# Altium schematic sheet Multiplexers.SchDoc
size A; DocumentNumber: 5; SheetNumber: 5; SheetTotal: 5
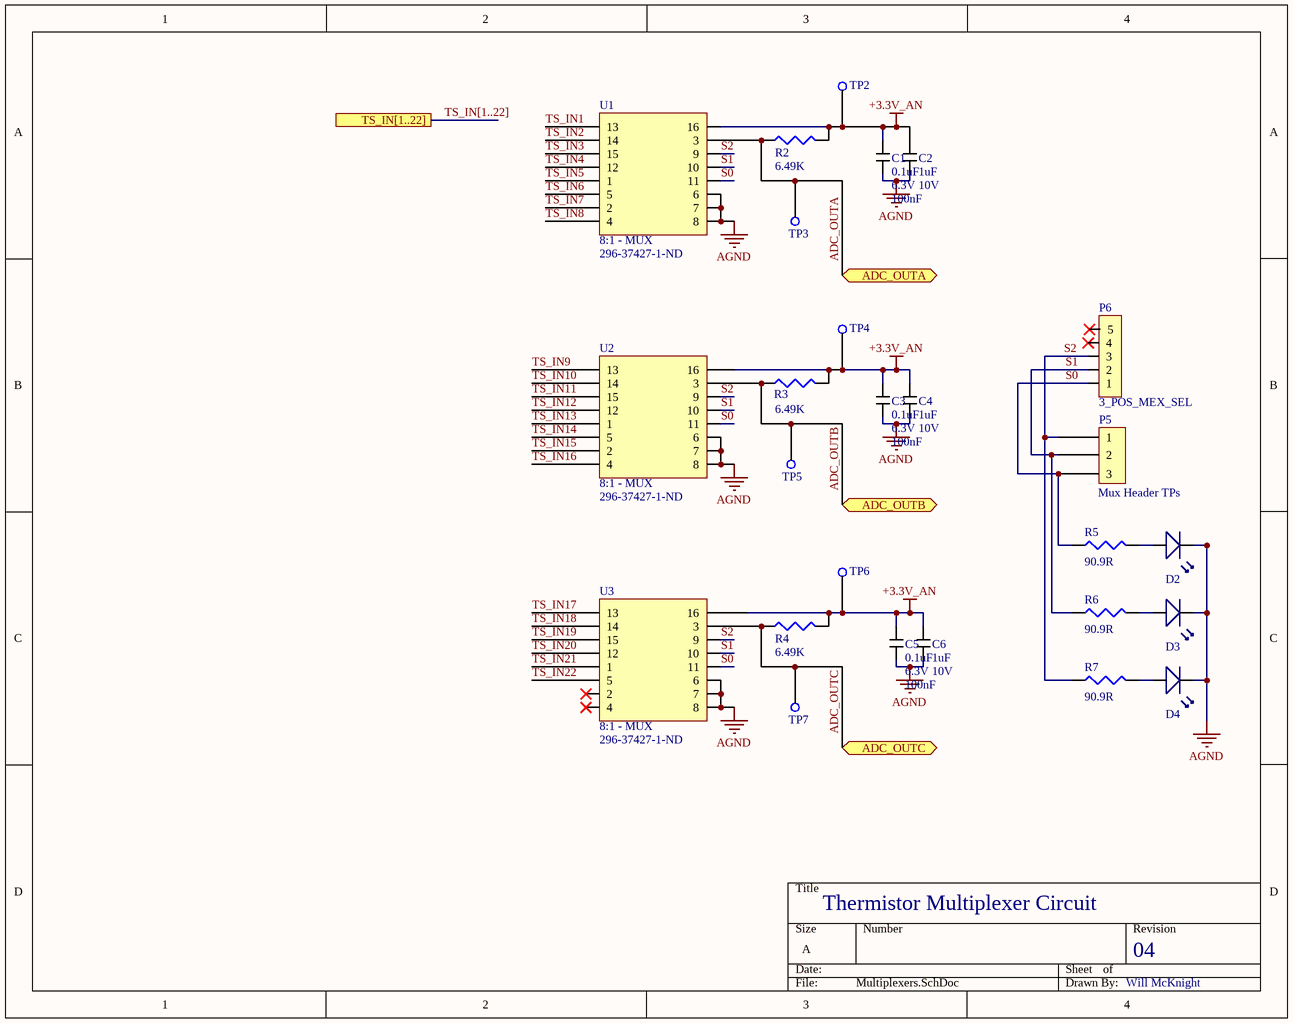
[diagram p0: Multiplexers.SchDoc]

## Parts
C1  0.1uF  Voltage Rating: 6.3V  Capacitance: 100nF  [0.1uF Bypass Capacitor]
C2  Voltage Rating: 10V  [1UF_SAMSUNG]  (hidden comment: 1uF)
C3  0.1uF  Voltage Rating: 6.3V  Capacitance: 100nF  [0.1uF Bypass Capacitor]
C4  Voltage Rating: 10V  [1UF_SAMSUNG]  (hidden comment: 1uF)
C5  0.1uF  Voltage Rating: 6.3V  Capacitance: 100nF  [0.1uF Bypass Capacitor]
C6  Voltage Rating: 10V  [1UF_SAMSUNG]  (hidden comment: 1uF)
D2  LED  [Green_SMD_LED]  (value not drawn)
D3  LED  [Green_SMD_LED]  (value not drawn)
D4  LED  [Green_SMD_LED]  (value not drawn)
P5  3 POS Mux Select Header  [Mux Select 3 Pos Header Pin]  (value not drawn)
P6  3_POS_MEX_SEL  [3POS_MUX_SEL]
R2  Resistance: 6.49K  [RESC2012X06N]  (hidden comment: 6.49kOhm SMD Resistor)
R3  Resistance: 6.49K  [RESC2012X06N]  (hidden comment: 6.49kOhm SMD Resistor)
R4  Resistance: 6.49K  [RESC2012X06N]  (hidden comment: 6.49kOhm SMD Resistor)
R5  Resistance: 90.9R  [Green_LED_Resistor_90.9]  (hidden comment: Green_LED_Res)
R6  Resistance: 90.9R  [Green_LED_Resistor_90.9]  (hidden comment: Green_LED_Res)
R7  Resistance: 90.9R  [Green_LED_Resistor_90.9]  (hidden comment: Green_LED_Res)
TP2  Test Point  [Test Point]  (value not drawn)
TP3  Test Point  [Test Point]  (value not drawn)
TP4  Test Point  [Test Point]  (value not drawn)
TP5  Test Point  [Test Point]  (value not drawn)
TP6  Test Point  [Test Point]  (value not drawn)
TP7  Test Point  [Test Point]  (value not drawn)
U1  8:1 - MUX  Supplier Part Number 1: 296-37427-1-ND  [8x1 16SOIC MUX]
U2  8:1 - MUX  Supplier Part Number 1: 296-37427-1-ND  [8x1 16SOIC MUX]
U3  8:1 - MUX  Supplier Part Number 1: 296-37427-1-ND  [8x1 16SOIC MUX]

## Ports
ADC_OUTA (bidir), ADC_OUTB (bidir), ADC_OUTC (bidir), TS_IN[1..22]

## Nets
+3.3V_AN: C1.2 C2.2 C3.2 C4.2 C5.2 C6.2 R2.2 R3.2 R4.2 TP2.1 TP4.1 TP6.1 U1.16 U2.16 U3.16
AGND: C1.1 C2.1 C3.1 C4.1 C5.1 C6.1 D2.1 D3.1 D4.1 U1.6 U1.7 U1.8 U2.6 U2.7 U2.8 U3.6 U3.7 U3.8
ADC_OUTA: R2.1 TP3.1 U1.3 ; port ADC_OUTA
ADC_OUTB: R3.1 TP5.1 U2.3 ; port ADC_OUTB
ADC_OUTC: R4.1 TP7.1 U3.3 ; port ADC_OUTC
S0: P5.3 P6.1 R5.1 U1.11 U2.11 U3.11
S1: P5.2 P6.2 R6.1 U1.10 U2.10 U3.10
S2: P5.1 P6.3 R7.1 U1.9 U2.9 U3.9
TS_IN1: U1.13
TS_IN2: U1.14
TS_IN3: U1.15
TS_IN4: U1.12
TS_IN5: U1.1
TS_IN6: U1.5
TS_IN7: U1.2
TS_IN8: U1.4
TS_IN9: U2.13
TS_IN10: U2.14
TS_IN11: U2.15
TS_IN12: U2.12
TS_IN13: U2.1
TS_IN14: U2.5
TS_IN15: U2.2
TS_IN16: U2.4
TS_IN17: U3.13
TS_IN18: U3.14
TS_IN19: U3.15
TS_IN20: U3.12
TS_IN21: U3.1
TS_IN22: U3.5
NetD2_2: D2.2 R5.2
NetD3_2: D3.2 R6.2
NetD4_2: D4.2 R7.2

Not connected (* = marked no-connect by the designer): P6 4* 5*; U3 2* 4*

## Buses and harness runs
bus TS_IN[1..22] = port TS_IN[1..22]

## Notes on the sheet
- (near P5) Mux Header TPs
- Thermistor Multiplexer Circuit
- 04
- Will McKnight

## Library data of the parts
C1 C3 C5 = 0.1uF Cap: 0.1uF Bypass Cap; Manufacturer: KEMET; Manufacturer Part Number: C0603C104K9RACTU; Dielectric Material: Ceramic; Tolerance: 10%; Dielectric: X7R; Dissipation Factor: 5%; Supplier 1: Digi-Key; Supplier Part Number 1: 399-15351-1-ND; RoHS: Yes; Mount: Surface Mount; Case/Package: 0603; Case Code (Imperial): 0603; Case Code (Metric): 1608; Min Operating Temperature: -55°C; Max Operating Temperature: 125°C; Package Quantity: 4000; Packaging: Tape and Reel; Voltage Rating (DC): 6.3V; Termination: SMD/SMT; Length: 1.6mm; Height: 0.8mm; Width: 0.8mm; Thickness: 0.034inch; ComponentLink1URL: https://datasheet.ciiva.com/13371/kem-c1002-x7r-smd-357932-13371879.pdf?src-supplier=Mouser; ComponentLink1Description: https://datasheet.ciiva.com/13371/kem-c1002-x7r-smd-357932-13371879.pdf?src-supplier=Mouser; Stock 1: 758; Pricing 1: 1=0.19000, 10=0.13800, 100=0.06480, 500=0.04546, 1000=0.03763 (USD)
C2 C4 C6 = 1uF Samsung Cap: Manufacturer Part Number: CL10B105KP8NNNC; Tolerance: 10%; Dielectric: X7R; Supplier 1: Digi-Key; Supplier Part Number 1: 1276-1946-1-ND; Manufacturer: Samsung; Mount: Surface Mount; Case/Package: 0603; Case Code (Metric): 1608; Case Code (Imperial): 0603; Contact Plating: Tin; Min Operating Temperature: -55°C; Max Operating Temperature: 125°C; Package Quantity: 1; Packaging: Tape and Reel; Voltage Rating (DC): 10V; Length: 1.6mm; Height: 0.8mm; Width: 0.031inch; Thickness: 0.035inch; Depth: 0.8mm; Radiation Hardening: No; Lead Free: Lead Free; ComponentLink1URL: https://media.digikey.com/pdf/Data%20Sheets/Samsung%20PDFs/CL_Series_MLCC_ds.pdf?src-supplier=Digi-Key; ComponentLink1Description: https://media.digikey.com/pdf/Data%20Sheets/Samsung%20PDFs/CL_Series_MLCC_ds.pdf?src-supplier=Digi-Key; ComponentLink2URL: http://www1.futureelectronics.com/doc/SAMSUNG/CL10B105KP8NNNC.pdf?src-supplier=Future+Electronics; ComponentLink2Description: http://www1.futureelectronics.com/doc/SAMSUNG/CL10B105KP8NNNC.pdf?src-supplier=Future+Electronics; ComponentLink3URL: https://www.verical.com/server-webapp/html/getDatasheet?partID=358410&src-supplier=Verical; ComponentLink3Description: https://www.verical.com/server-webapp/html/getDatasheet?partID=358410&src-supplier=Verical; Stock 1: 10781730; Pricing 1: 1=0.1, 10=0.052, 100=0.0233, 500=0.0166, 1000=0.0131 (USD); Capacitance: 1uF
D2-D4 = GREEN_LED: Manufacturer: Dialight; Manufacturer Part Number: 5988070107F; Color: Green; Lens Color: Colorless,Clear; Forward Voltage: 2V; Forward Current: 20mA; Wavelength: 570nm; Luminous Intensity: 20mcd; Viewing Angle: 140°; Lens Style: Flat,Rectangular,Diffused,Colorless,Clear; Dominant Wavelength: 568nm; Number of Elements: 1; Power Dissipation: 60mW; Reverse Voltage: 5V; Lens Transparency: Clear; Lens Size: 0.8mm; Supplier 1: Digi-Key; Stock 1: 228546; Pricing 1: 1=0.46, 10=0.33, 25=0.2528, 100=0.1648, 250=0.1209, 500=0.1026, 1000=0.0843 (USD); Mount: Surface Mount; Case/Package: 0603; Number of Pins: 2; Case Code (Metric): 1608; Case Code (Imperial): 0603; Min Operating Temperature: -30°C; Max Operating Temperature: 100°C; Package Quantity: 4000; Packaging: Tape and Reel; Illumination Color: Green; Test Current: 20mA; Number of LEDs: 1; Length: 1.6mm; Height: 0.7mm; Depth: 0.8mm; Width: 0.8mm; Radiation Hardening: No; Lead Free: Lead Free; REACH SVHC: No SVHC; ComponentLink1URL: http://www.mouser.com/ds/2/109/SMT_selector_guide-267443.pdf?src-supplier=Mouser; ComponentLink1Description: http://www.mouser.com/ds/2/109/SMT_selector_guide-267443.pdf?src-supplier=Mouser; ComponentLink2URL: http://uk.rs-online.com/webdocs/0ae2/0900766b80ae2975.pdf?src-supplier=RSComponents; ComponentLink2Description: http://uk.rs-online.com/webdocs/0ae2/0900766b80ae2975.pdf?src-supplier=RSComponents; ComponentLink3URL: http://www.farnell.com/datasheets/1720200.pdf?src-supplier=Element14; ComponentLink3Description: http://www.farnell.com/datasheets/1720200.pdf?src-supplier=Element14; ComponentLink4URL: https://media.digikey.com/pdf/Data%20Sheets/Dialight%20PDFs/598_Series_0603_Pkg.pdf?src-supplier=Digi-Key; ComponentLink4Description: https://media.digikey.com/pdf/Data%20Sheets/Dialight%20PDFs/598_Series_0603_Pkg.pdf?src-supplier=Digi-Key; ComponentLink5URL: http://www.farnell.com/datasheets/1484480.pdf?src-supplier=Element14; ComponentLink5Description: http://www.farnell.com/datasheets/1484480.pdf?src-supplier=Element14; ComponentLink6URL: https://www.alliedelec.com/m/d/745256ca487aea7b70ea31e2d673d5bb.pdf?src-supplier=Allied+Electronics; ComponentLink6Description: https://www.alliedelec.com/m/d/745256ca487aea7b70ea31e2d673d5bb.pdf?src-supplier=Allied+Electronics; ComponentLink7URL: http://www.onlinecomponents.com/productFiles/mf-DIA/mdei5980603.pdf?src-supplier=Onlinecomponents.com; ComponentLink7Description: http://www.onlinecomponents.com/productFiles/mf-DIA/mdei5980603.pdf?src-supplier=Onlinecomponents.com; ComponentLink8URL: https://www.verical.com/server-webapp/html/getDatasheet?partID=146438&src-supplier=Verical; ComponentLink8Description: https://www.verical.com/server-webapp/html/getDatasheet?partID=146438&src-supplier=Verical; ComponentLink9URL: http://www.dialight.com/Assets/Brochures_And_Catalogs/Indication/SMT_selector_guide.pdf?src-supplier=Future+Electronics; ComponentLink9Description: http://www.dialight.com/Assets/Brochures_And_Catalogs/Indication/SMT_selector_guide.pdf?src-supplier=Future+Electronics; Supplier Part Number 1: 350-2035-1-ND
P5 = 3 POS Mux Select Header: Mux Sel Header TP; Manufacturer: Adam Equipment; Manufacturer Part Number: PH1RA-03-UA; Supplier 1: Digi-Key; Stock 1: 4630; Pricing 1: 1=0.12000, 10=0.11300, 100=0.06960, 500=0.05760, 1000=0.05040, 5000=0.04320, 10000=0.04200 (USD); RoHS: Yes; Lead Free: Lead Free; ComponentLink1URL: https://datasheet.ciiva.com/16476/page-292-295-16476086.pdf?src-supplier=Future+Electronics; ComponentLink1Description: https://datasheet.ciiva.com/16476/page-292-295-16476086.pdf?src-supplier=Future+Electronics; Supplier Part Number 1: 2057-PH1RA-03-UA-ND
P6 = 3_POS_MEX_SEL: Connector Header Surface Mount, Right Angle 3 position 0.049" (1.25mm); Manufacturer: Molex; Manufacturer Part Number: 505567-0371; Connector Type: Header,Male Pin; Number of Positions: 3; Supplier 1: Digi-Key; Stock 1: 2041; Pricing 1: 1=0.84000, 10=0.74100, 100=0.63940, 500=0.52312 (USD); RoHS: No; Mount: Surface Mount; Contact Plating: Tin; Contact Material: Brass; Contact Shape: Square; Insulation Material: Nylon; Insulation Color: Black; Min Operating Temperature: -40°C; Max Operating Temperature: 105°C; Fastening Type: Ramp; Packaging: Cut Tape; Number of Rows: 1; Termination: Solder; Flammability Rating: UL94 V-0; ComponentLink1URL: https://www.molex.com/pdm_docs/sd/5055670371_sd.pdf?src-supplier=Digi-Key; ComponentLink1Description: https://www.molex.com/pdm_docs/sd/5055670371_sd.pdf?src-supplier=Digi-Key; ComponentLink2URL: http://www.farnell.com/datasheets/2551041.pdf?src-supplier=Newark; ComponentLink2Description: http://www.farnell.com/datasheets/2551041.pdf?src-supplier=Newark
R2-R4 = 6.49kOhm SMD Resistor: Manufacturer: Panasonic; Manufacturer Part Number: ERA6AEB6491V; Tolerance: 0.1%; Temperature Coefficient: 25ppm/°C; Power Rating: 125mW; Voltage Rating: 100V; Supplier 1: Digi-Key; Stock 1: 15147; Pricing 1: 1=0.36, 10=0.302, 100=0.1182, 1000=0.0495, 2500=0.0454 (USD); Mount: Surface Mount; Case/Package: 0805; Number of Pins: 2; Contact Plating: Tin; Case Code (Metric): 2012; Case Code (Imperial): 0805; Min Operating Temperature: -55°C; Max Operating Temperature: 155°C; Composition: Thin Film,Metal Film; Packaging: Tape and Reel; Package Quantity: 1; Number of Terminations: 2; Termination: SMD/SMT; Military Standard: Not; Max Power Dissipation: 125mW; Voltage Rating (DC): 100V; Features: Automotive AEC-Q200; Length: 2mm; Height: 0.5mm; Width: 1.25mm; Depth: 1.25mm; Radiation Hardening: No; REACH SVHC: No SVHC; Lead Free: Lead Free; ComponentLink1URL: http://www.farnell.com/datasheets/485442.pdf?src-supplier=Farnell; ComponentLink1Description: http://www.farnell.com/datasheets/485442.pdf?src-supplier=Farnell; ComponentLink2URL: http://www.mouser.com/ds/2/315/AOA0000CE26-32660.pdf?src-supplier=Mouser; ComponentLink2Description: http://www.mouser.com/ds/2/315/AOA0000CE26-32660.pdf?src-supplier=Mouser; ComponentLink3URL: http://www.farnell.com/datasheets/2059650.pdf?src-supplier=Farnell; ComponentLink3Description: http://www.farnell.com/datasheets/2059650.pdf?src-supplier=Farnell; ComponentLink4URL: http://uk.rs-online.com/webdocs/0eb1/0900766b80eb1d8c.pdf?src-supplier=RSComponents; ComponentLink4Description: http://uk.rs-online.com/webdocs/0eb1/0900766b80eb1d8c.pdf?src-supplier=RSComponents; ComponentLink5URL: http://www.farnell.com/datasheets/485442.pdf?src-supplier=Element14; ComponentLink5Description: http://www.farnell.com/datasheets/485442.pdf?src-supplier=Element14; ComponentLink6URL: http://www.produktinfo.conrad.com/datenblaetter/1100000-1199999/001181295-da-01-en-WIDERSTAND_ERA_0805_6K49_0_1__5000ST.pdf?src-supplier=Conrad; ComponentLink6Description: http://www.produktinfo.conrad.com/datenblaetter/1100000-1199999/001181295-da-01-en-WIDERSTAND_ERA_0805_6K49_0_1__5000ST.pdf?src-supplier=Conrad; Supplier Part Number 1: P6.49KDACT-ND
R5-R7 = Green_LED_Res: Manufacturer: Panasonic; Manufacturer Part Number: ERJ-1GNF90R9C; Power Rating: 50mW; Tolerance: 1%; Voltage Rating: 25V; Temperature Coefficient: 200ppm/°C; Voltage Rating (DC): 50V; Mount: Surface Mount; Case/Package: 0201; Case Code (Imperial): 0201; Case Code (Metric): 0603; Contact Plating: Tin,Matte; Min Operating Temperature: -55°C; Max Operating Temperature: 125°C; Package Quantity: 15000; Packaging: Tape and Reel; Composition: Thick Film; Number of Terminations: 2; Max Power Dissipation: 50mW; Termination: SMD/SMT; Length: 0.024inch; Height: 0.01inch; Width: 0.3mm; Radiation Hardening: No; Supplier 1: Digi-Key; Stock 1: 401780; Pricing 1: 1=0.10000, 10=0.02400, 100=0.00970, 1000=0.00437, 2500=0.00379 (USD); RoHS: Yes; Military Standard: Not; Depth: 0.8mm; Lead Free: Lead Free; ComponentLink1URL: https://datasheet.ciiva.com/15189/getdatasheetpartid-326528-15189836.pdf?src-supplier=Verical; ComponentLink1Description: https://datasheet.ciiva.com/15189/getdatasheetpartid-326528-15189836.pdf?src-supplier=Verical; ComponentLink2URL: https://datasheet.ciiva.com/12558/rc0603-272842-12558285.pdf?src-supplier=Mouser; ComponentLink2Description: https://datasheet.ciiva.com/12558/rc0603-272842-12558285.pdf?src-supplier=Mouser; Supplier Part Number 1: 311-90.9HRCT-ND
U1-U3 = 8:1 - MUX: Current Therm 8:1 Mux; Manufacturer: Texas Instruments; Manufacturer Part Number: SN74LV4051ATPWRQ1; Max Supply Voltage: 5.5V; Min Supply Voltage: 2V; Bandwidth: 35MHz; Propagation Delay: 7ns; Number of Channels: 1; Number of Inputs: 8; Logic Function: Multiplexer,Demultiplexer; On-State Resistance: 75R; Operating Supply Current: 20uA; Turn-On Delay Time: 20ns; Supply Type: Single; High Level Output Current: 25mA; Supplier 1: Digi-Key; Stock 1: 2492; Pricing 1: 1=0.72000, 10=0.63600, 100=0.48730, 500=0.38522, 1000=0.30818 (USD); Mount: Surface Mount; Case/Package: TSSOP; Number of Pins: 16; Weight: 0.002169oz; Contact Plating: Gold; Min Operating Temperature: -40°C; Max Operating Temperature: 105°C; Package Quantity: 1; Packaging: Tape and Reel; Number of Outputs: 1; Turn-Off Delay Time: 20ns; Number of Circuits: 1; Number of Bits: 8; Low Level Output Current: 25mA; Radiation Hardening: No; REACH SVHC: No SVHC; Lead Free: Lead Free; ComponentLink1URL: http://www.ti.com/lit/ds/symlink/sn74lv4051a-q1.pdf?src-supplier=Digi-Key; ComponentLink1Description: http://www.ti.com/lit/ds/symlink/sn74lv4051a-q1.pdf?src-supplier=Digi-Key; ComponentLink2URL: http://www.ti.com/lit/gpn/sn74lv4051a-q1?src-supplier=Mouser; ComponentLink2Description: http://www.ti.com/lit/gpn/sn74lv4051a-q1?src-supplier=Mouser; ComponentLink3URL: https://www.verical.com/server-webapp/html/getDatasheet?partID=137249&src-supplier=Verical; ComponentLink3Description: https://www.verical.com/server-webapp/html/getDatasheet?partID=137249&src-supplier=Verical; ComponentLink4URL: http://focus.ti.com/lit/ds/symlink/sn74lv4051a-q1.pdf?src-supplier=Avnet; ComponentLink4Description: http://focus.ti.com/lit/ds/symlink/sn74lv4051a-q1.pdf?src-supplier=Avnet; ComponentLink5URL: http://www.produktinfo.conrad.com/datenblaetter/1100000-1199999/001187277-da-01-en-IC_MUX_DE_SN74LV4051ATPWRQ1_TSSOP_16_TID.pdf?src-supplier=Conrad; ComponentLink5Description: http://www.produktinfo.conrad.com/datenblaetter/1100000-1199999/001187277-da-01-en-IC_MUX_DE_SN74LV4051ATPWRQ1_TSSOP_16_TID.pdf?src-supplier=Conrad; RoHS: Yes; -3db Bandwidth: 35MHz; ComponentLink6URL: https://datasheet.ciiva.com/15127/getdatasheetpartid-348177-15127781.pdf?src-supplier=Verical; ComponentLink6Description: https://datasheet.ciiva.com/15127/getdatasheetpartid-348177-15127781.pdf?src-supplier=Verical; ComponentLink7URL: https://datasheet.ciiva.com/14435/sn74lv4051a-q1-14435640.pdf?src-supplier=Avnet; ComponentLink7Description: https://datasheet.ciiva.com/14435/sn74lv4051a-q1-14435640.pdf?src-supplier=Avnet; ComponentLink8URL: https://datasheet.ciiva.com/29645/sn74lv4051a-q1-29645693.pdf?src-supplier=Digi-Key; ComponentLink8Description: https://datasheet.ciiva.com/29645/sn74lv4051a-q1-29645693.pdf?src-supplier=Digi-Key; ComponentLink9URL: https://datasheet.ciiva.com/29645/sn74lv4051a-q1-29645694.pdf?src-supplier=Digi-Key; ComponentLink9Description: https://datasheet.ciiva.com/29645/sn74lv4051a-q1-29645694.pdf?src-supplier=Digi-Key; ComponentLink10URL: https://datasheet.ciiva.com/29645/sn74lv4051a-q1-29645695.pdf?src-supplier=Digi-Key; ComponentLink10Description: https://datasheet.ciiva.com/29645/sn74lv4051a-q1-29645695.pdf?src-supplier=Digi-Key